# EAGLE design moon-rover (EAGLE 6.3)
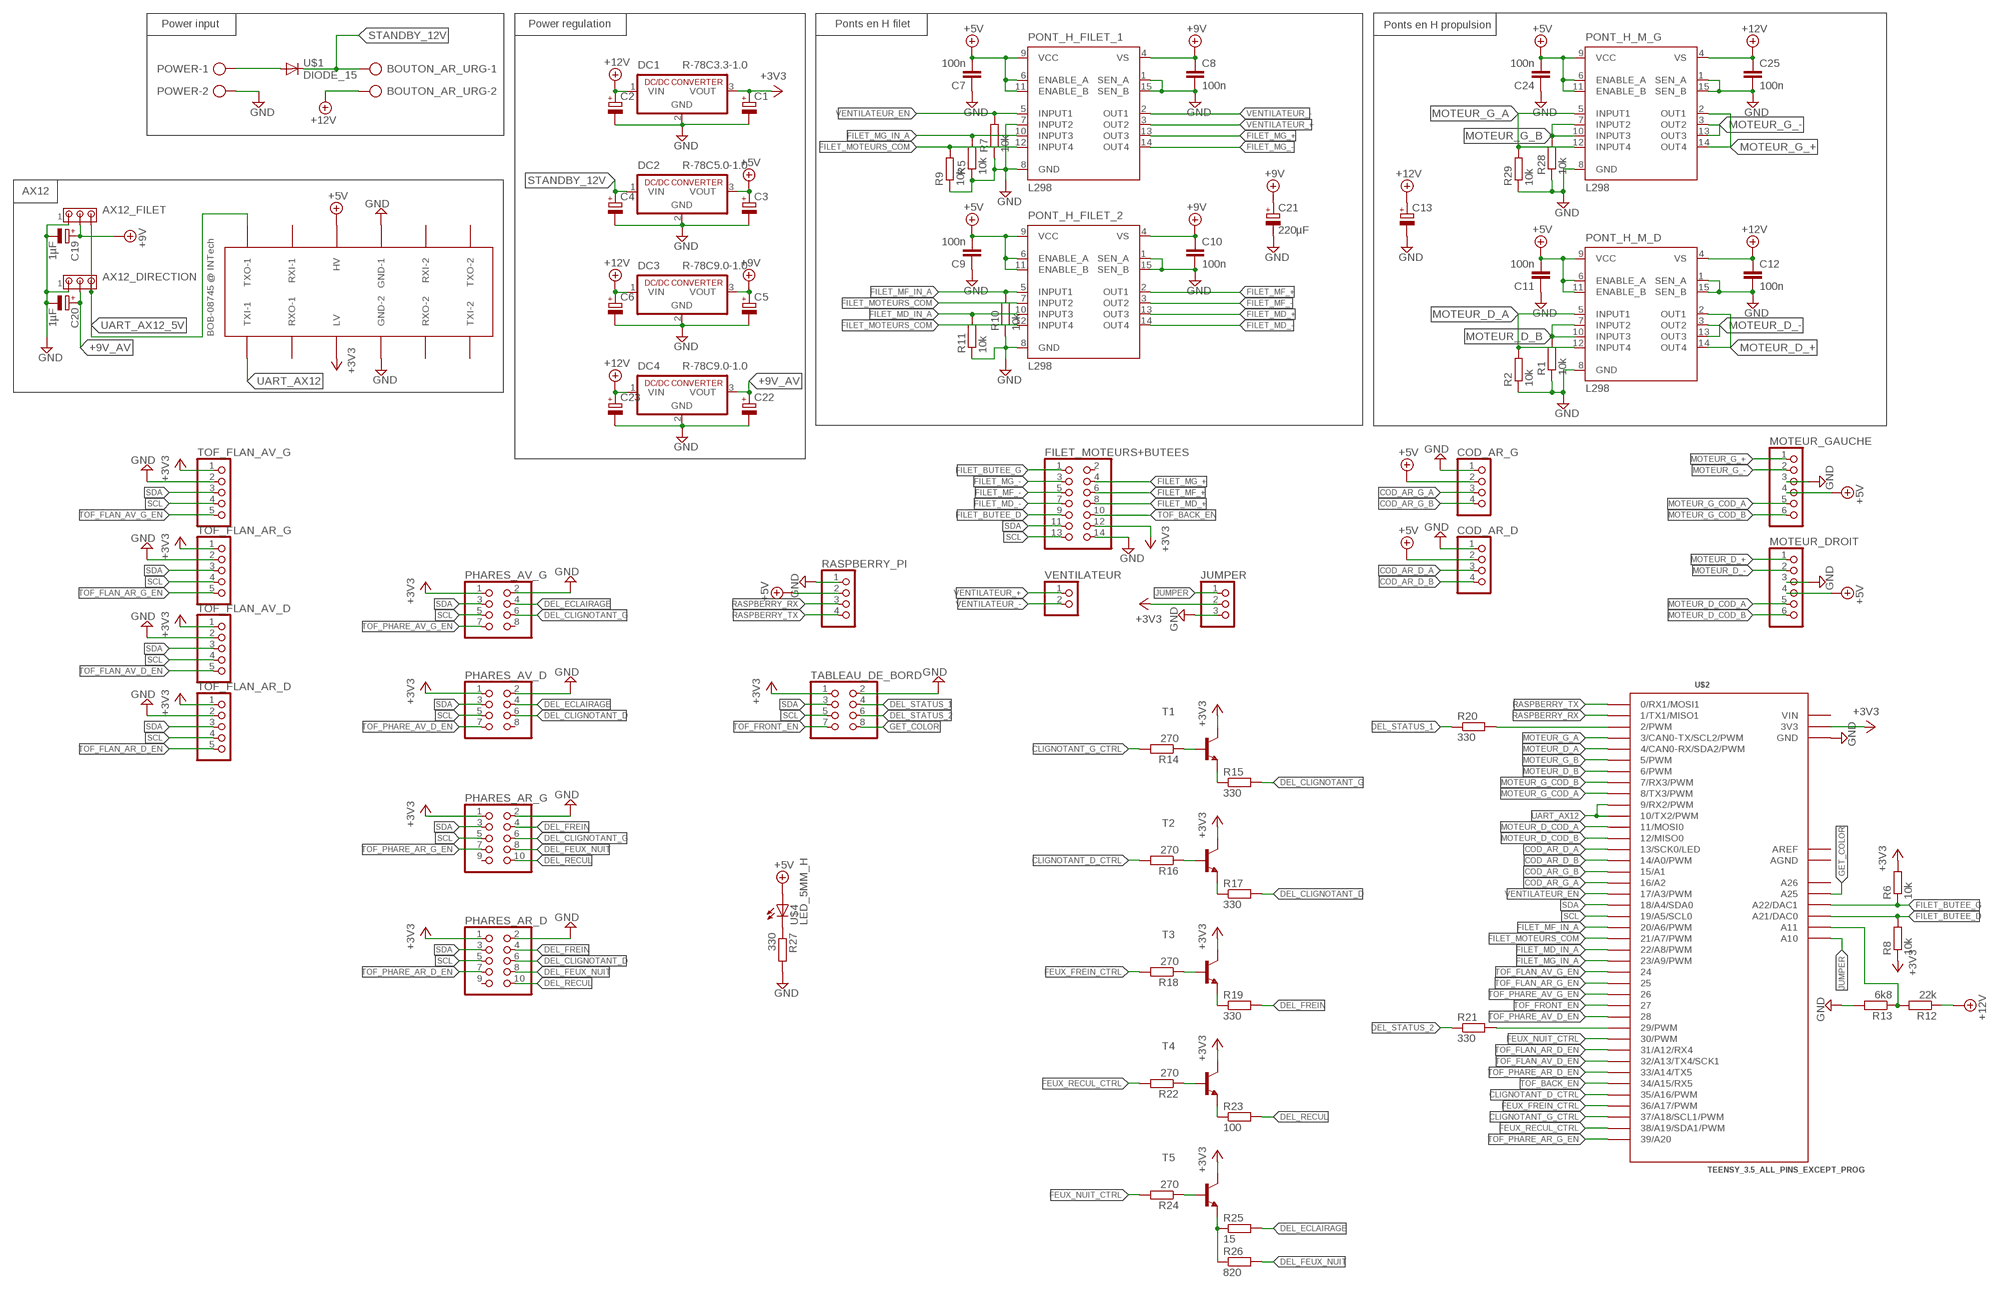
[diagram p0: schematic, sheet 1]

## Parts
AX12_DIRECTION  MTA03-100  [10X03MTA]
AX12_FILET  MTA03-100  [10X03MTA]
BOUTON_AR_URG  AK300/2  [AK300/2]
C1  CPOL-EUE2.5-6  [E2,5-6]
C2  CPOL-EUE2.5-6  [E2,5-6]
C3  CPOL-EUE2.5-6  [E2,5-6]
C4  CPOL-EUE2.5-6  [E2,5-6]
C5  CPOL-EUE2.5-6  [E2,5-6]
C6  CPOL-EUE2.5-6  [E2,5-6]
C7  100n  C-EU050-024X044  [C050-024X044]
C8  100n  C-EU050-024X044  [C050-024X044]
C9  100n  C-EU050-024X044  [C050-024X044]
C10  100n  C-EU050-024X044  [C050-024X044]
C11  100n  C-EU050-024X044  [C050-024X044]
C12  100n  C-EU050-024X044  [C050-024X044]
C13  CPOL-EUE5-13  [E5-13]
C19  1µF  CPOL-EUE2.5-5  [E2,5-5]
C20  1µF  CPOL-EUE2.5-5  [E2,5-5]
C21  220µF  CPOL-EUE3.5-8  [E3,5-8]
C22  CPOL-EUE2.5-6  [E2,5-6]
C23  CPOL-EUE2.5-6  [E2,5-6]
C24  100n  C-EU050-024X044  [C050-024X044]
C25  100n  C-EU050-024X044  [C050-024X044]
COD_AR_D  PINHD-1X4/90  [1X04/90]
COD_AR_G  PINHD-1X4/90  [1X04/90]
DC1  R-78C3.3-1.0  [SIP3]
DC2  R-78C5.0-1.0  [SIP3]
DC3  R-78C9.0-1.0  [SIP3]
DC4  R-78C9.0-1.0  [SIP3]
FILET_MOTEURS+BUTEES  PINHD-2X7  [2X07]
JUMPER  PINHD-1X3/90  [1X03/90]
MOTEUR_DROIT  PINHD-1X6/90  [1X06/90]
MOTEUR_GAUCHE  PINHD-1X6/90  [1X06/90]
PHARES_AR_D  PINHD-2X5  [2X05]
PHARES_AR_G  PINHD-2X5  [2X05]
PHARES_AV_D  PINHD-2X4  [2X04]
PHARES_AV_G  PINHD-2X4  [2X04]
PONT_H_FILET_1  L298  [MULTIWATT-15]
PONT_H_FILET_2  L298  [MULTIWATT-15]
PONT_H_M_D  L298  [MULTIWATT-15]
PONT_H_M_G  L298  [MULTIWATT-15]
POWER  AK300/2  [AK300/2]
R1  10k  R-EU_0204/7  [0204/7]
R2  10k  R-EU_0204/7  [0204/7]
R5  10k  R-EU_0204/7  [0204/7]
R6  10k  R-EU_0204/7  [0204/7]
R7  10k  R-EU_0204/7  [0204/7]
R8  10k  R-EU_0204/7  [0204/7]
R9  10k  R-EU_0204/7  [0204/7]
R10  10k  R-EU_0204/7  [0204/7]
R11  10k  R-EU_0204/7  [0204/7]
R12  22k  R-EU_0204/7  [0204/7]
R13  6k8  R-EU_0204/7  [0204/7]
R14  270  R-EU_0204/7  [0204/7]
R15  330  R-EU_0207/2V  [0207/2V]
R16  270  R-EU_0204/7  [0204/7]
R17  330  R-EU_0207/2V  [0207/2V]
R18  270  R-EU_0204/7  [0204/7]
R19  330  R-EU_0207/2V  [0207/2V]
R20  330  R-EU_0204/7  [0204/7]
R21  330  R-EU_0207/2V  [0207/2V]
R22  270  R-EU_0204/7  [0204/7]
R23  100  R-EU_0207/2V  [0207/2V]
R24  270  R-EU_0207/2V  [0207/2V]
R25  15  R-EU_0207/2V  [0207/2V]
R26  820  R-EU_0207/2V  [0207/2V]
R27  330  R-EU_0204/7  [0204/7]
R28  10k  R-EU_0204/7  [0204/7]
R29  10k  R-EU_0204/7  [0204/7]
RASPBERRY_PI  PINHD-1X4/90  [1X04/90]
T1  BC237-NPN-TO92-CBE  [TO92-CBE]
T2  BC237-NPN-TO92-CBE  [TO92-CBE]
T3  BC237-NPN-TO92-CBE  [TO92-CBE]
T4  BC237-NPN-TO92-CBE  [TO92-CBE]
T5  BC237-NPN-TO92-CBE  [TO92-CBE]
TABLEAU_DE_BORD  PINHD-2X4  [2X04]
TOF_FLAN_AR_D  PINHD-1X5  [1X05]
TOF_FLAN_AR_G  PINHD-1X5  [1X05]
TOF_FLAN_AV_D  PINHD-1X5  [1X05]
TOF_FLAN_AV_G  PINHD-1X5  [1X05]
U$1  DIODE_15  [DO201-15]
U$2  TEENSY_3.5_ALL_PINS_EXCEPT_PROG  [TEENSY_3.5_ALL_PINS_EXCEPT_PROG]
U$3  BOB-08745  [BOB-08745]
U$4  LED_5MM_H  [Q62902-B155]
VENTILATEUR  PINHD-1X2/90  [1X02/90]

## Nets
+3V3: C1.+ DC1.3(VOUT) FILET_MOTEURS+BUTEES.12 JUMPER.2 PHARES_AR_D.1 PHARES_AR_G.1 PHARES_AV_D.1 PHARES_AV_G.1 R6.2 R8.1 T1.C T2.C T3.C T4.C T5.C TABLEAU_DE_BORD.1 TOF_FLAN_AR_D.1 TOF_FLAN_AR_G.1 TOF_FLAN_AV_D.1 TOF_FLAN_AV_G.1 U$2.3.3V3(3V3) U$2.3.3V(3V3) U$3.LV
+5V: C3.+ C7.2 C9.2 C11.2 C24.2 COD_AR_D.2 COD_AR_G.2 DC2.3(VOUT) MOTEUR_DROIT.4 MOTEUR_GAUCHE.4 PONT_H_FILET_1.6(ENABLE_A) PONT_H_FILET_1.9(VCC) PONT_H_FILET_1.11(ENABLE_B) PONT_H_FILET_2.6(ENABLE_A) PONT_H_FILET_2.9(VCC) PONT_H_FILET_2.11(ENABLE_B) PONT_H_M_D.6(ENABLE_A) PONT_H_M_D.9(VCC) PONT_H_M_D.11(ENABLE_B) PONT_H_M_G.6(ENABLE_A) PONT_H_M_G.9(VCC) PONT_H_M_G.11(ENABLE_B) RASPBERRY_PI.2 U$3.HV U$4.A+
+9V: AX12_FILET.2 C5.+ C8.1 C10.1 C19.+ C21.+ DC3.3(VOUT) PONT_H_FILET_1.4(VS) PONT_H_FILET_2.4(VS)
+9V_AV: AX12_DIRECTION.2 C20.+ C22.+ DC4.3(VOUT)
+12V: BOUTON_AR_URG.2 C2.+ C6.+ C12.1 C13.+ C23.+ C25.1 DC1.1(VIN) DC3.1(VIN) DC4.1(VIN) PONT_H_M_D.4(VS) PONT_H_M_G.4(VS) R12.1
CLIGNOTANT_D_CTRL: R16.2 U$2.35/A16(35/A16/PWM)
CLIGNOTANT_G_CTRL: R14.2 U$2.37/A18(37/A18/SCL1/PWM)
COD_AR_D_A: COD_AR_D.3 U$2.13(13/SCK0/LED)
COD_AR_D_B: COD_AR_D.4 U$2.14/A0(14/A0/PWM)
COD_AR_G_A: COD_AR_G.3 U$2.16/A2
COD_AR_G_B: COD_AR_G.4 U$2.15/A1
DEL_CLIGNOTANT_D: PHARES_AR_D.6 PHARES_AV_D.6 R17.2
DEL_CLIGNOTANT_G: PHARES_AR_G.6 PHARES_AV_G.6 R15.2
DEL_ECLAIRAGE: PHARES_AV_D.4 PHARES_AV_G.4 R25.2
DEL_FEUX_NUIT: PHARES_AR_D.8 PHARES_AR_G.8 R26.2
DEL_FREIN: PHARES_AR_D.4 PHARES_AR_G.4 R19.2
DEL_RECUL: PHARES_AR_D.10 PHARES_AR_G.10 R23.2
DEL_STATUS_1: R20.1 TABLEAU_DE_BORD.4
DEL_STATUS_2: R21.1 TABLEAU_DE_BORD.6
FEUX_FREIN_CTRL: R18.2 U$2.36/A17(36/A17/PWM)
FEUX_NUIT_CTRL: R24.2 U$2.30(30/PWM)
FEUX_RECUL_CTRL: R22.2 U$2.38/A19(38/A19/SDA1/PWM)
FILET_BUTEE_D: FILET_MOTEURS+BUTEES.9 R8.2 U$2.A21(A21/DAC0)
FILET_BUTEE_G: FILET_MOTEURS+BUTEES.1 R6.1 U$2.A22(A22/DAC1)
FILET_MD_+: FILET_MOTEURS+BUTEES.8 PONT_H_FILET_2.13(OUT3)
FILET_MD_-: FILET_MOTEURS+BUTEES.7 PONT_H_FILET_2.14(OUT4)
FILET_MD_IN_A: PONT_H_FILET_2.10(INPUT3) R11.2 U$2.22/A8(22/A8/PWM)
FILET_MF_+: FILET_MOTEURS+BUTEES.6 PONT_H_FILET_2.2(OUT1)
FILET_MF_-: FILET_MOTEURS+BUTEES.5 PONT_H_FILET_2.3(OUT2)
FILET_MF_IN_A: PONT_H_FILET_2.5(INPUT1) R10.2 U$2.20/A6(20/A6/PWM)
FILET_MG_+: FILET_MOTEURS+BUTEES.4 PONT_H_FILET_1.13(OUT3)
FILET_MG_-: FILET_MOTEURS+BUTEES.3 PONT_H_FILET_1.14(OUT4)
FILET_MG_IN_A: PONT_H_FILET_1.10(INPUT3) R5.2 U$2.23/A9(23/A9/PWM)
FILET_MOTEURS_COM: PONT_H_FILET_1.12(INPUT4) PONT_H_FILET_2.7(INPUT2) PONT_H_FILET_2.12(INPUT4) R9.2 U$2.21/A7(21/A7/PWM)
GET_COLOR: TABLEAU_DE_BORD.8 U$2.A25
GND: AX12_DIRECTION.1 AX12_FILET.1 C1.- C2.- C3.- C4.- C5.- C6.- C7.1 C8.2 C9.1 C10.2 C11.1 C12.2 C13.- C19.- C20.- C21.- C22.- C23.- C24.1 C25.2 COD_AR_D.1 COD_AR_G.1 DC1.2(GND) DC2.2(GND) DC3.2(GND) DC4.2(GND) FILET_MOTEURS+BUTEES.14 JUMPER.3 MOTEUR_DROIT.3 MOTEUR_GAUCHE.3 PHARES_AR_D.2 PHARES_AR_G.2 PHARES_AV_D.2 PHARES_AV_G.2 PONT_H_FILET_1.1(SEN_A) PONT_H_FILET_1.7(INPUT2) PONT_H_FILET_1.8(GND) PONT_H_FILET_1.15(SEN_B) PONT_H_FILET_2.1(SEN_A) PONT_H_FILET_2.8(GND) PONT_H_FILET_2.15(SEN_B) PONT_H_M_D.1(SEN_A) PONT_H_M_D.8(GND) PONT_H_M_D.15(SEN_B) PONT_H_M_G.1(SEN_A) PONT_H_M_G.8(GND) PONT_H_M_G.15(SEN_B) POWER.2 R1.1 R2.1 R5.1 R7.1 R9.1 R10.1 R11.1 R13.2 R27.2 R28.1 R29.1 RASPBERRY_PI.1 TABLEAU_DE_BORD.2 TOF_FLAN_AR_D.2 TOF_FLAN_AR_G.2 TOF_FLAN_AV_D.2 TOF_FLAN_AV_G.2 U$2.GND U$2.GND1(GND) U$2.GND3(GND) U$2.GND4(GND) U$3.GND-1 U$3.GND-2
JUMPER: JUMPER.1 U$2.A10
MOTEUR_D_+: MOTEUR_DROIT.1 PONT_H_M_D.2(OUT1) PONT_H_M_D.14(OUT4)
MOTEUR_D_-: MOTEUR_DROIT.2 PONT_H_M_D.3(OUT2) PONT_H_M_D.13(OUT3)
MOTEUR_D_A: PONT_H_M_D.5(INPUT1) PONT_H_M_D.12(INPUT4) R2.2 U$2.4(4/CAN0-RX/SDA2/PWM)
MOTEUR_D_B: PONT_H_M_D.7(INPUT2) PONT_H_M_D.10(INPUT3) R1.2 U$2.6(6/PWM)
MOTEUR_D_COD_A: MOTEUR_DROIT.5 U$2.11(11/MOSI0)
MOTEUR_D_COD_B: MOTEUR_DROIT.6 U$2.12(12/MISO0)
MOTEUR_G_+: MOTEUR_GAUCHE.1 PONT_H_M_G.2(OUT1) PONT_H_M_G.14(OUT4)
MOTEUR_G_-: MOTEUR_GAUCHE.2 PONT_H_M_G.3(OUT2) PONT_H_M_G.13(OUT3)
MOTEUR_G_A: PONT_H_M_G.5(INPUT1) PONT_H_M_G.12(INPUT4) R29.2 U$2.3(3/CAN0-TX/SCL2/PWM)
MOTEUR_G_B: PONT_H_M_G.7(INPUT2) PONT_H_M_G.10(INPUT3) R28.2 U$2.5(5/PWM)
MOTEUR_G_COD_A: MOTEUR_GAUCHE.5 U$2.8(8/TX3/PWM)
MOTEUR_G_COD_B: MOTEUR_GAUCHE.6 U$2.7(7/RX3/PWM)
N$2: R14.1 T1.B
N$4: R12.2 R13.1 U$2.A11
N$5: R15.1 T1.E
N$8: R27.1 U$4.K-(C-)
N$9: POWER.1 U$1.A(A+)
N$11: R16.1 T2.B
N$12: R17.1 T2.E
N$15: R18.1 T3.B
N$16: R19.1 T3.E
N$19: R20.2 U$2.2(2/PWM)
N$20: R21.2 U$2.29(29/PWM)
N$21: R22.1 T4.B
N$22: R23.1 T4.E
N$25: R24.1 T5.B
N$26: R25.1 R26.1 T5.E
RASPBERRY_RX: RASPBERRY_PI.3 U$2.1(1/TX1/MISO1)
RASPBERRY_TX: RASPBERRY_PI.4 U$2.0(0/RX1/MOSI1)
SCL: FILET_MOTEURS+BUTEES.13 PHARES_AR_D.5 PHARES_AR_G.5 PHARES_AV_D.5 PHARES_AV_G.5 TABLEAU_DE_BORD.5 TOF_FLAN_AR_D.4 TOF_FLAN_AR_G.4 TOF_FLAN_AV_D.4 TOF_FLAN_AV_G.4 U$2.19/A5(19/A5/SCL0)
SDA: FILET_MOTEURS+BUTEES.11 PHARES_AR_D.3 PHARES_AR_G.3 PHARES_AV_D.3 PHARES_AV_G.3 TABLEAU_DE_BORD.3 TOF_FLAN_AR_D.3 TOF_FLAN_AR_G.3 TOF_FLAN_AV_D.3 TOF_FLAN_AV_G.3 U$2.18/A4(18/A4/SDA0)
STANDBY_12V: BOUTON_AR_URG.1 C4.+ DC2.1(VIN) U$1.C(C-)
TOF_BACK_EN: FILET_MOTEURS+BUTEES.10 U$2.34/A15(34/A15/RX5)
TOF_FLAN_AR_D_EN: TOF_FLAN_AR_D.5 U$2.31/A12(31/A12/RX4)
TOF_FLAN_AR_G_EN: TOF_FLAN_AR_G.5 U$2.25
TOF_FLAN_AV_D_EN: TOF_FLAN_AV_D.5 U$2.32/A13(32/A13/TX4/SCK1)
TOF_FLAN_AV_G_EN: TOF_FLAN_AV_G.5 U$2.24
TOF_FRONT_EN: TABLEAU_DE_BORD.7 U$2.27
TOF_PHARE_AR_D_EN: PHARES_AR_D.7 U$2.33/A14(33/A14/TX5)
TOF_PHARE_AR_G_EN: PHARES_AR_G.7 U$2.39/A20
TOF_PHARE_AV_D_EN: PHARES_AV_D.7 U$2.28
TOF_PHARE_AV_G_EN: PHARES_AV_G.7 U$2.26
UART_AX12: U$2.9(9/RX2/PWM) U$2.10(10/TX2/PWM) U$3.TXI-1
UART_AX12_5V: AX12_DIRECTION.3 AX12_FILET.3 U$3.TXO-1
VENTILATEUR_+: PONT_H_FILET_1.3(OUT2) VENTILATEUR.1
VENTILATEUR_-: PONT_H_FILET_1.2(OUT1) VENTILATEUR.2
VENTILATEUR_EN: PONT_H_FILET_1.5(INPUT1) R7.2 U$2.17/A3(17/A3/PWM)
Unconnected: FILET_MOTEURS+BUTEES.2 PHARES_AR_D.9 PHARES_AR_G.9 PHARES_AV_D.8 PHARES_AV_G.8 U$2.A26 U$3.RXI-1 U$3.RXI-2 U$3.RXO-1 U$3.RXO-2 U$3.TXI-2 U$3.TXO-2

## Notes on the sheet
- Power input | Power regulation | Ponts en H filet | Ponts en H propulsion
- AX12

## Power pins joined to a net without a drawn wire
AGND: U$2.AGND
AREF: U$2.AREF
VIN: U$2.VIN

## Library data of the parts
AX12_DIRECTION AX12_FILET = con-amp:MTA03-100: AMP connector
BOUTON_AR_URG POWER = con-ptr500:AK300/2: CONNECTOR; OC_FARNELL: unknown; OC_NEWARK: unknown
C1-C6 C19-C23 = 1NTech_RLCD:CPOL-EU: POLARIZED CAPACITOR, European symbol
C7-C12 C24 C25 = 1NTech_RLCD:C-EU: CAPACITOR, European symbol
C13 = resistor:CPOL-EU: POLARIZED CAPACITOR, European symbol
COD_AR_D COD_AR_G RASPBERRY_PI = pinhead:PINHD-1X4: PIN HEADER
DC1-DC4 = dc-dc-converter:R-78C*-1.0: INNOLINE DC/DC-Converter 1.0 AMP SIP3 Single Output Source: Data sheet <http://www.mikrocontroller.net/attachment/150645/157764-da-01-en-DC_DC_WANDLER_R_78C5_0_1_0.pdf>
FILET_MOTEURS+BUTEES = pinhead:PINHD-2X7: PIN HEADER
JUMPER = pinhead:PINHD-1X3: PIN HEADER
MOTEUR_DROIT MOTEUR_GAUCHE = pinhead:PINHD-1X6: PIN HEADER
PHARES_AR_D PHARES_AR_G = pinhead:PINHD-2X5: PIN HEADER
PHARES_AV_D PHARES_AV_G TABLEAU_DE_BORD = pinhead:PINHD-2X4: PIN HEADER
PONT_H_FILET_1 PONT_H_FILET_2 PONT_H_M_D PONT_H_M_G = st-microelectronics:L298: DUAL FULL-BRIDGE DRIVER; MPN: L298N; OC_FARNELL: 1589425; OC_NEWARK: 32M1527
R1 R2 R5-R29 = 1NTech_RLCD:R-EU_: RESISTOR, European symbol
T1-T5 = transistor:*-NPN-: NPN Transistror BF959 corrected 2008.03.06
TOF_FLAN_AR_D TOF_FLAN_AR_G TOF_FLAN_AV_D TOF_FLAN_AV_G = pinhead:PINHD-1X5: PIN HEADER
U$1 = 1NTech_RLCD:DIODE
U$2 = Teensy_3_and_LC_Series_Boards_v1.4:TEENSY_3.5_ALL_PINS_EXCEPT_PROG
U$3 = BOB-08745_CF_INTech:BOB-08745: Convertisseur de niveau logique BOB-08745
U$4 = 1NTech_RLCD:LED
VENTILATEUR = pinhead:PINHD-1X2: PIN HEADER

## Board
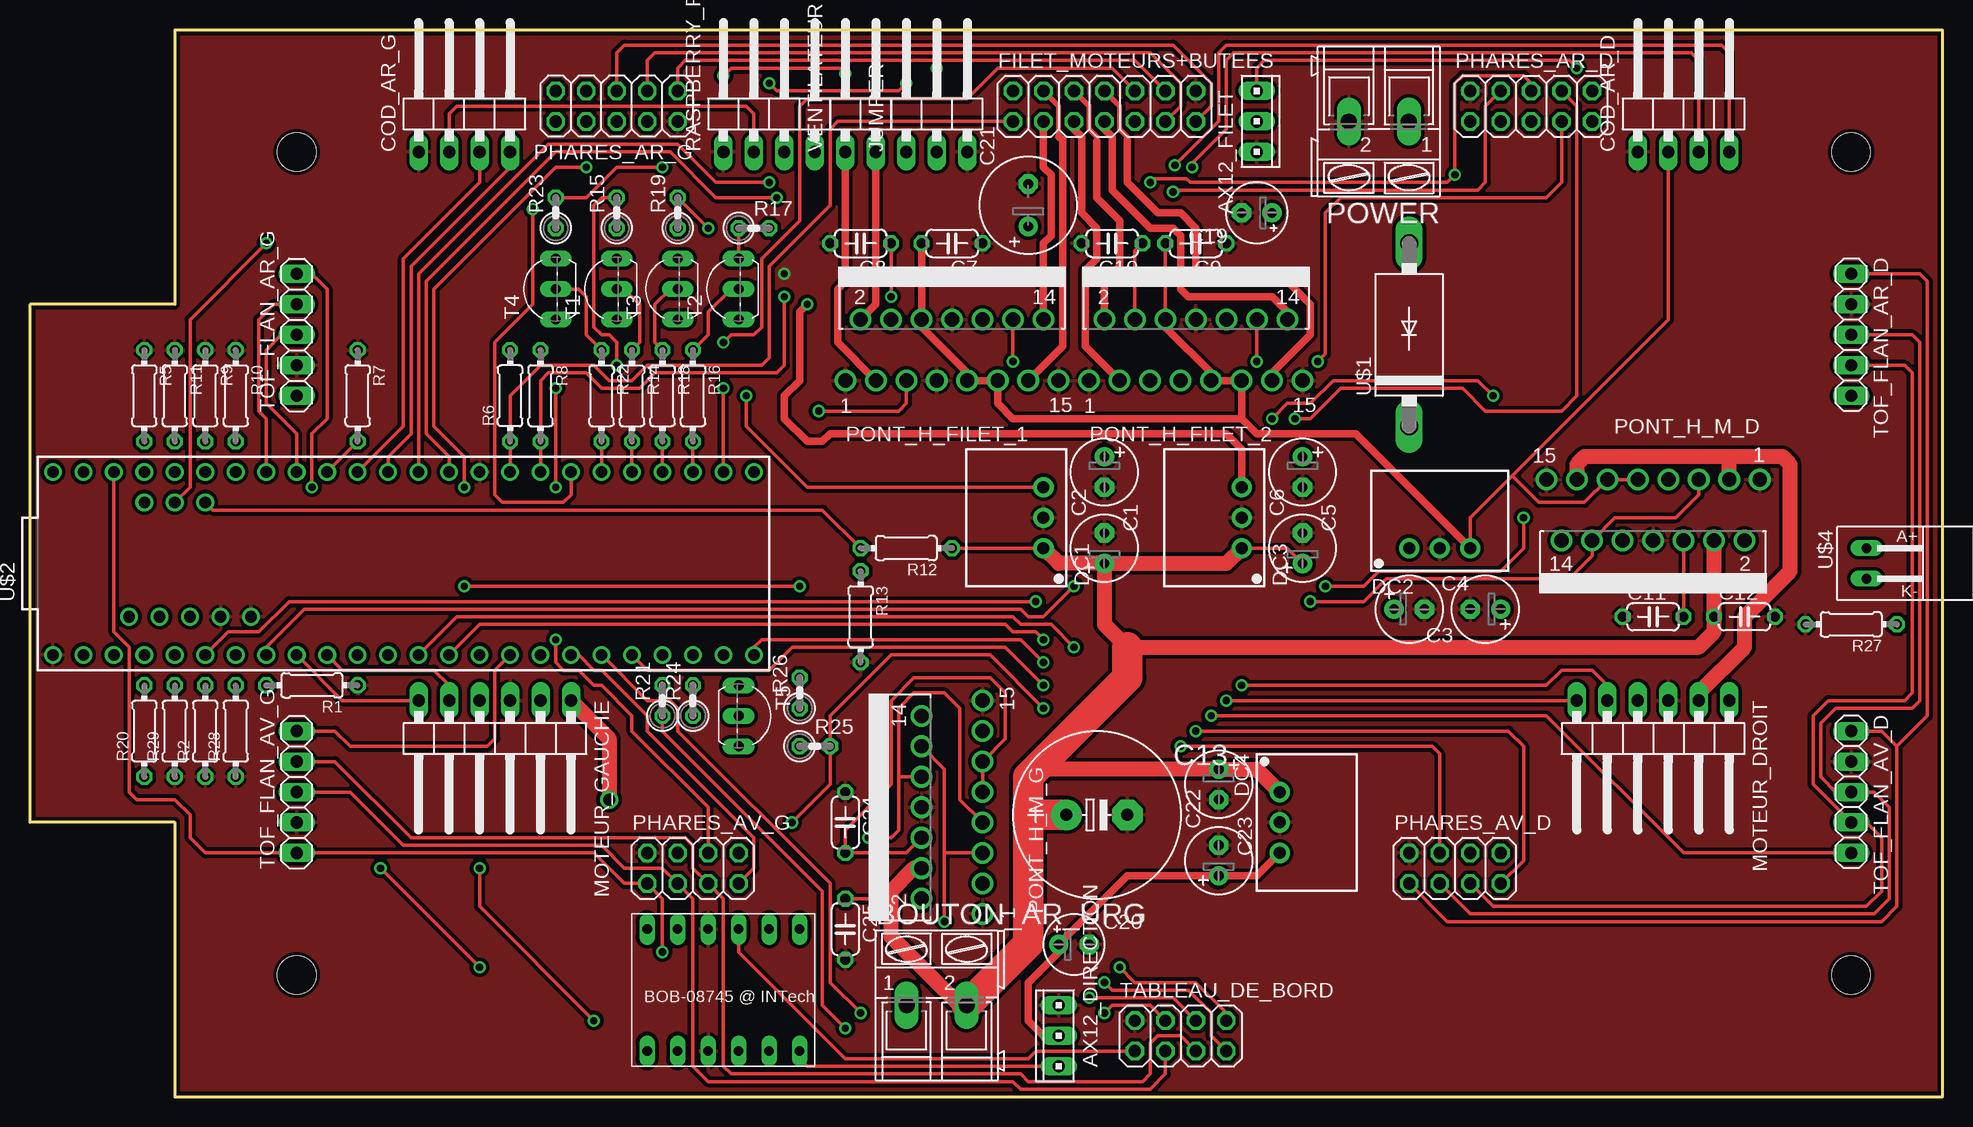
[diagram p1: board, top side]
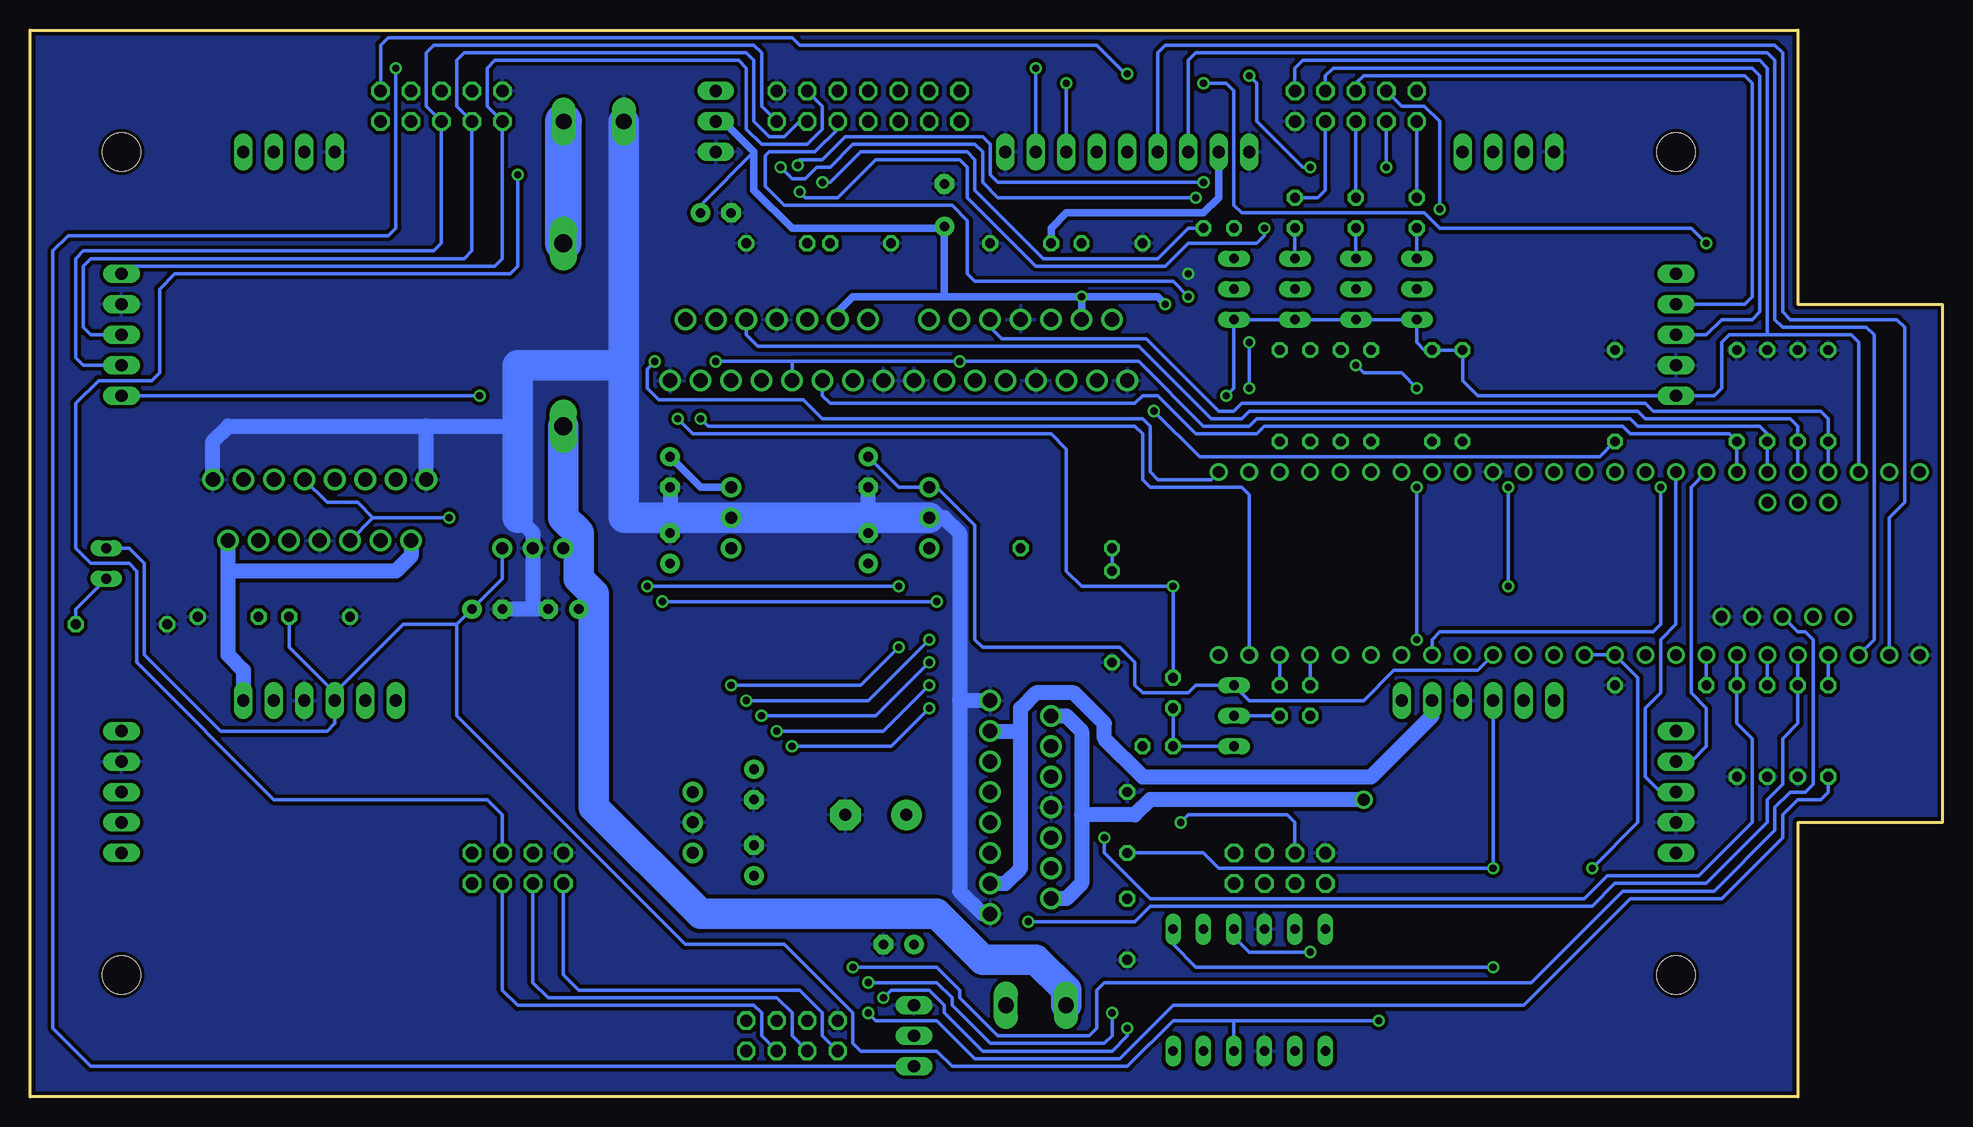
[diagram p2: board, bottom side, seen from below]

Size 159.38 x 88.9 mm. Coordinates in mm from the lower left corner, seen from the top.
Outline: 12.06,0 159.38,0 159.38,88.9 12.06,88.9 12.06,66.04 0,66.04 0,22.86 12.06,22.86 12.06,0
Copper layers (1*16): Top 0.035mm / dielectric 1.5mm / Bottom 0.035mm
Design rules "default *": minimum track width 12mil, minimum drill 23mil, track to track 12mil, track to pad 12mil, pad to pad 12mil, via to via 12mil, smd to smd 8mil, copper to edge 12mil, drill to drill 8mil, minimum pad ring 10mil, minimum via ring 8mil, stop-mask expansion 4mil, vias tented up to drill 0mil, thermal gap 10mil
Holes 3.2 mm at 22.23,10.16 22.23,78.74 151.76,78.74 151.76,10.16

### Footprints (pad centres in the part's own frame; a part is rotated, then mirrored left to right if it is on the bottom)
10X03MTA = drill 1.016 long: 1 2.54,0; 2 0,0; 3 -2.54,0
AK300/2 = drill 1.321 long: 1 -2.515,0; 2 2.489,0
E2,5-6 = drill 0.813 pad 1.6: + -1.27,0 | drill 0.813 pad 1.6 octagon: - 1.27,0
C050-024X044 = drill 0.813 octagon: 1 -2.54,0; 2 2.54,0
E5-13 = drill 1.016 pad 2.54: + -2.54,0 | drill 1.016 pad 2.54 octagon: - 2.54,0
E2,5-5 = drill 0.813 pad 1.6: + -1.27,0 | drill 0.813 pad 1.6 octagon: - 1.27,0
E3,5-8 = drill 0.813 pad 1.6: + -1.778,0 | drill 0.813 pad 1.6 octagon: - 1.778,0
1X04/90 = drill 1.016 long: 1 -3.81,-3.81; 2 -1.27,-3.81; 3 1.27,-3.81; 4 3.81,-3.81
SIP3 = drill 1 pad 1.676: 1 -2.54,0; 2 0,0; 3 2.54,0
2X07 = drill 1.016 octagon: 1 -7.62,-1.27; 2 -7.62,1.27; 3 -5.08,-1.27; 4 -5.08,1.27; 5 -2.54,-1.27; 6 -2.54,1.27; 7 0,-1.27; 8 0,1.27; 9 2.54,-1.27; 10 2.54,1.27; 11 5.08,-1.27; 12 5.08,1.27; 13 7.62,-1.27; 14 7.62,1.27
1X03/90 = drill 1.016 long: 1 -2.54,-3.81; 2 0,-3.81; 3 2.54,-3.81
1X06/90 = drill 1.016 long: 1 -6.35,-3.81; 2 -3.81,-3.81; 3 -1.27,-3.81; 4 1.27,-3.81; 5 3.81,-3.81; 6 6.35,-3.81
2X05 = drill 1.016 octagon: 1 -5.08,-1.27; 2 -5.08,1.27; 3 -2.54,-1.27; 4 -2.54,1.27; 5 0,-1.27; 6 0,1.27; 7 2.54,-1.27; 8 2.54,1.27; 9 5.08,-1.27; 10 5.08,1.27
2X04 = drill 1.016 octagon: 1 -3.81,-1.27; 2 -3.81,1.27; 3 -1.27,-1.27; 4 -1.27,1.27; 5 1.27,-1.27; 6 1.27,1.27; 7 3.81,-1.27; 8 3.81,1.27
MULTIWATT-15 = drill 1.2: 1 -8.89,-7.62; 2 -7.62,-2.54; 3 -6.35,-7.62; 4 -5.08,-2.54; 5 -3.81,-7.62; 6 -2.54,-2.54; 7 -1.27,-7.62; 8 0,-2.54; 9 1.27,-7.62; 10 2.54,-2.54; 11 3.81,-7.62; 12 5.08,-2.54; 13 6.35,-7.62; 14 7.62,-2.54; 15 8.89,-7.62
0204/7 = drill 0.813 octagon: 1 -3.81,0; 2 3.81,0
0207/2V = drill 0.813 octagon: 1 -1.27,0; 2 1.27,0
TO92-CBE = drill 0.813 long: B 0,0; C -2.54,0; E 2.54,0
1X05 = drill 1.016 long: 1 -5.08,0; 2 -2.54,0; 3 0,0; 4 2.54,0; 5 5.08,0
DO201-15 = drill 1.499 long: A 7.62,0; C -7.62,0
TEENSY_3.5_ALL_PINS_EXCEPT_PROG = drill 0.965: 0 -7.62,27.94; 1 -7.62,25.4; 2 -7.62,22.86; 3 -7.62,20.32; 3.3V 7.62,25.4; 3.3V3 -7.62,-5.08; 4 -7.62,17.78; 5 -7.62,15.24; 6 -7.62,12.7; 7 -7.62,10.16; 8 -7.62,7.62; 9 -7.62,5.08; 10 -7.62,2.54; 11 -7.62,0; 12 -7.62,-2.54; 13 7.62,-2.54; 14/A0 7.62,0; 15/A1 7.62,2.54; 16/A2 7.62,5.08; 17/A3 7.62,7.62; 18/A4 7.62,10.16; 19/A5 7.62,12.7; 20/A6 7.62,15.24; 21/A7 7.62,17.78; 22/A8 7.62,20.32; 23/A9 7.62,22.86; 24 -7.62,-7.62; 25 -7.62,-10.16; 26 -7.62,-12.7; 27 -7.62,-15.24; 28 -7.62,-17.78; 29 -7.62,-20.32; 30 -7.62,-22.86; 31/A12 -7.62,-25.4; 32/A13 -7.62,-27.94; 33/A14 7.62,-27.94; 34/A15 7.62,-25.4; 35/A16 7.62,-22.86; 36/A17 7.62,-20.32; 37/A18 7.62,-17.78; 38/A19 7.62,-15.24; 39/A20 7.62,-12.7; A10 5.08,20.32; A11 5.08,17.78; A21 7.62,-10.16; A22 7.62,-7.62; A25 -4.445,19.05; A26 -4.445,21.59; AGND 7.62,27.94; AREF 5.08,22.86; GND -7.62,30.48; GND1 7.62,-5.08; GND3 -4.445,16.51; GND4 -4.445,13.97; NC -4.445,24.13; VIN 7.62,30.48
BOB-08745 = drill 0.8 long: GND-1 1.27,5.08; GND-2 1.27,-5.08; HV -1.27,5.08; LV -1.27,-5.08; RXI-1 -3.81,5.08; RXI-2 3.81,5.08; RXO-1 -3.81,-5.08; RXO-2 3.81,-5.08; TXI-1 -6.35,-5.08; TXI-2 6.35,-5.08; TXO-1 -6.35,5.08; TXO-2 6.35,5.08
Q62902-B155 = drill 0.813 long: A+ 7.62,-1.27; K- 7.62,1.27
1X02/90 = drill 1.016 long: 1 -1.27,-3.81; 2 1.27,-3.81

### Placement (x,y rotation side)
AX12_DIRECTION  85.72,5.08 90 top
AX12_FILET  102.23,81.28 270 top
BOUTON_AR_URG  75.56,7.62 0 top
C1  89.53,52.07 270 top
C2  89.53,45.72 90 top
C3  121.28,40.64 180 top
C4  114.94,40.64 0 top
C5  106.05,52.07 270 top
C6  106.05,45.72 90 top
C7  76.83,71.12 180 top
C8  69.22,71.12 180 top
C9  97.16,71.12 180 top
C10  90.17,71.12 180 top
C11  135.25,40.01 0 top
C12  142.88,40.01 0 top
C13  88.9,23.5 0 top
C19  102.23,73.66 180 top
C20  87,12.7 0 top
C21  83.19,74.3 90 top
C22  99.06,19.68 90 top
C23  99.06,26.04 270 top
C24  67.95,22.86 270 top
C25  67.95,13.97 270 top
COD_AR_D  137.8,82.55 0 top
COD_AR_G  36.2,82.55 0 top
DC1  84.45,48.26 90 top
DC2  117.47,45.72 0 top
DC3  100.97,48.26 90 top
DC4  104.14,22.86 270 top
FILET_MOTEURS+BUTEES  89.53,82.55 0 top
JUMPER  75.56,82.55 0 top
MOTEUR_DROIT  135.25,29.21 180 top
MOTEUR_GAUCHE  38.73,29.21 180 top
PHARES_AR_D  125.09,82.55 0 top
PHARES_AR_G  48.89,82.55 180 top
PHARES_AV_D  118.75,19.05 0 top
PHARES_AV_G  55.24,19.05 0 top
PONT_H_FILET_1  76.83,67.31 0 top
PONT_H_FILET_2  97.16,67.31 0 top
PONT_H_M_D  135.25,43.81 180 top
PONT_H_M_G  71.75,24.13 90 top
POWER  112.39,81.28 180 top
R1  23.49,34.29 180 top
R2  14.61,30.48 90 top
R5  9.52,58.42 270 top
R6  40.01,58.42 90 top
R7  27.3,58.42 270 top
R8  42.55,58.42 270 top
R9  14.61,58.42 270 top
R10  17.14,58.42 270 top
R11  12.06,58.42 270 top
R12  73.03,45.72 180 top
R13  69.22,40.01 270 top
R14  50.16,58.42 270 top
R15  48.89,73.66 90 top
R16  55.24,58.42 270 top
R17  60.32,72.39 0 top
R18  52.7,58.42 270 top
R19  53.97,73.66 90 top
R20  9.52,30.48 90 top
R21  52.7,33.02 90 top
R22  47.62,58.42 270 top
R23  43.81,73.66 90 top
R24  55.24,33.02 90 top
R25  65.41,29.21 0 top
R26  64.14,33.66 90 top
R27  151.76,39.37 180 top
R28  17.14,30.48 90 top
R29  12.06,30.48 90 top
RASPBERRY_PI  61.59,82.55 0 top
T1  48.89,67.31 90 top
T2  59.05,67.31 90 top
T3  53.97,67.31 90 top
T4  43.81,67.31 90 top
T5  59.05,31.75 270 top
TABLEAU_DE_BORD  95.88,5.08 0 top
TOF_FLAN_AR_D  151.76,63.5 270 top
TOF_FLAN_AR_G  22.23,63.5 90 top
TOF_FLAN_AV_D  151.76,25.4 270 top
TOF_FLAN_AV_G  22.23,25.4 90 top
U$1  114.94,63.5 90 top
U$2  32.38,44.45 90 top
U$3  57.78,8.89 180 top
U$4  160.66,44.45 180 top
VENTILATEUR  69.22,82.55 0 top

### Tracks (layer width: path | path; a pad name or v marks a point on that pad's centre or on a via)
+3V3  (via drill 0.6)
  Top 0.305: TABLEAU_DE_BORD.1 83.82,3.81 83.19,3.17 67.95,3.17 59.05,12.06 U$3.LV | TOF_FLAN_AV_D.1 154.31,30.48 155.57,29.21 | 155.57,29.21 155.57,15.88 154.31,14.61 118.11,14.61 PHARES_AV_D.1 | TOF_FLAN_AR_D.1 157.48,68.58 158.12,67.94 158.12,31.75 155.57,29.21 | PHARES_AR_G.1 53.97,85.72 54.61,86.36 75.56,86.36 | 75.56,86.36 92.08,86.36 FILET_MOTEURS+BUTEES.12 | 75.56,86.36 v75.56,85.72 | DC1.3 64.77,50.8 59.69,55.88 v59.69,58.42 | U$2.3.3V 6.98,38.73 8.25,37.47 8.25,25.4 8.89,24.77 12.06,24.77 13.33,23.5 13.33,21.59 14.61,20.32 TOF_FLAN_AV_G.1 46.99,20.32 49.53,17.78 PHARES_AV_G.1 52.7,16.51 v52.7,12.06
  Bottom 0.305: TABLEAU_DE_BORD.1 93.34,5.08 93.34,6.99 95.25,8.89 113.66,8.89 114.94,10.16 PHARES_AV_D.1 | TOF_FLAN_AR_D.1 151.13,69.22 120.65,69.22 120.02,69.85 PHARES_AR_D.1 121.28,82.55 121.28,85.72 120.65,86.36 100.33,86.36 99.69,85.72 99.69,80.64 98.42,79.38 94.61,79.38 93.34,80.64 93.34,82.55 FILET_MOTEURS+BUTEES.12 | 14.61,63.5 14.61,85.72 15.24,86.36 53.34,86.36 53.97,85.72 PHARES_AR_G.1 | U$2.3.3V 6.98,62.87 7.62,63.5 14.61,63.5 | 14.61,63.5 17.78,63.5 18.41,62.87 18.41,59.05 19.05,58.42 TOF_FLAN_AR_G.1 38.73,58.42 40.01,59.69 R6.2 R8.1 43.18,62.23 43.81,62.87 T4.C T1.C T3.C T2.C 59.05,59.05 v59.69,58.42 | C1.+ 87,50.8 DC1.3 83.82,50.8 80.64,47.62 80.64,38.1 80.01,37.47 68.58,37.47 67.31,36.2 67.31,34.29 66.67,33.66 62.86,33.66 62.23,34.29 T5.C 57.78,33.02 48.26,33.02 45.72,35.56 38.73,35.56 U$2.3.3V3 | v75.56,85.72 JUMPER.2 | v52.7,12.06 57.78,12.06 59.05,13.34 U$3.LV
+5V  (via drill 0.6)
  Top 0.305: PONT_H_FILET_2.6 C9.2 | RASPBERRY_PI.2 60.32,81.92 59.69,82.55 35.56,82.55 34.92,81.92 COD_AR_G.2 | COD_AR_D.2 136.53,64.77 123.51,51.75 | 123.51,51.75 120.02,48.26 DC2.3 | PONT_H_M_D.6 C11.2 | PONT_H_M_D.9 PONT_H_M_D.11 129.54,49.53 125.73,49.53 123.51,51.75 | PONT_H_M_G.6 73.03,20.32 C24.2 67.95,22.23 71.75,26.04 71.75,33.02 73.66,34.92 80.01,34.92 81.28,33.66 81.28,29.84 PONT_H_M_G.11 PONT_H_M_G.9 | v46.99,6.35 37.46,15.88 v37.46,19.05
  Top 0.61: C7.2 PONT_H_FILET_1.6 74.3,64.14 78.11,60.33 PONT_H_FILET_1.9 PONT_H_FILET_1.11 80.64,57.78 81.91,56.52 100.97,56.52 | DC2.3 110.49,55.24 102.23,55.24 100.97,56.52 | 100.97,56.52 PONT_H_FILET_2.11 PONT_H_FILET_2.9 98.42,60.33 94.61,64.14 PONT_H_FILET_2.6
  Bottom 0.305: DC2.3 120.02,43.18 C3.+ 123.83,39.37 | U$4.A+ 151.13,45.72 149.86,44.45 149.86,36.83 143.51,30.48 134.62,30.48 133.99,31.11 MOTEUR_DROIT.4 133.99,33.66 | MOTEUR_GAUCHE.4 v37.46,19.05 60.32,19.05 61.59,20.32 C24.2 | v46.99,6.35 59.05,6.35 | 59.05,6.35 64.14,6.35 67.95,2.54 82.55,2.54 83.82,3.81 90.17,3.81 90.8,4.45 90.8,6.99 96.52,12.7 104.77,12.7 123.83,31.75 123.83,39.37 | U$3.HV 59.05,6.35 | 123.83,39.37 128.27,39.37 133.99,33.66 | C11.2 137.8,37.47 133.99,33.66
  Bottom 0.61: C7.2 74.3,72.39 73.03,73.66 61.59,73.66 60.32,74.93 RASPBERRY_PI.2
+9V  (via drill 0.6)
  Top 0.305: v71.75,66.67 C8.1 | C10.1 92.08,70.48 PONT_H_FILET_2.4
  Top 0.61: v64.77,66.04 64.14,65.41 64.14,59.69 62.86,58.42 62.86,56.52 64.77,54.61 66.04,54.61 66.67,55.24 99.69,55.24 100.97,53.98 DC3.3
  Bottom 0.305: 99.06,78.74 103.5,74.3 C19.+
  Bottom 0.61: v71.75,66.67 65.41,66.67 v64.77,66.04 | v71.75,66.67 83.19,66.67 | 83.19,66.67 90.8,66.67 92.08,65.41 PONT_H_FILET_2.4 | 83.19,66.67 C21.+ 83.31,72.39 95.88,72.39 99.06,75.56 99.06,78.74 101.6,81.28 AX12_FILET.2 | PONT_H_FILET_1.4 v71.75,66.67 | DC3.3 103.5,50.8 C5.+
+9V_AV
  Top 0.61: AX12_DIRECTION.2 84.45,5.08 83.19,6.35 83.19,9.53 85.72,12.06 C20.+ 91.44,18.41 C22.+ 102.23,18.41 DC4.3
+12V
  Top 0.305: DC3.1 104.77,45.72 C6.+ | DC1.1 R12.1 | C25.1 71.75,16.51 | 83.19,27.3 83.19,26.67
  Top 1.27: C2.+ 85.72,44.45 DC1.1 | C2.+ 99.69,44.45 DC3.1 | C2.+ 89.53,39.37 91.44,37.47 139.06,37.47 140.34,38.73 C12.1 PONT_H_M_D.4 | 83.19,27.3 C23.+ 102.23,27.3 DC4.1 | 83.19,12.75 83.19,12.7 78.11,7.62 77.47,7.62 71.75,13.34 71.75,16.51 71.75,17.14 73.66,19.05 PONT_H_M_G.4
  Top 2.54: BOUTON_AR_URG.2 83.19,12.75 83.19,23.5 | 91.44,37.47 91.44,34.92 83.19,26.67 83.19,23.5 | C13.+ 83.19,23.5
CLIGNOTANT_D_CTRL
  Top 0.305: R16.2 U$2.35/A16
CLIGNOTANT_G_CTRL
  Top 0.305: U$2.37/A18 R14.2
COD_AR_D_A  (via drill 0.6)
  Top 0.305: U$2.13 34.92,53.34 33.02,55.24 33.02,67.94 43.81,78.74 53.34,78.74 57.15,74.93 v62.23,74.93 | COD_AR_D.3 139.06,86.36 138.43,87 100.33,87 99.69,86.36 99.69,80.64 96.84,77.79 v96.84,77.47
  Bottom 0.305: v62.23,74.93 78.74,74.93 80.01,76.2 80.01,78.74 80.64,79.38 90.8,79.38 92.71,77.47 93.82,77.47 94.77,76.52 95.88,76.52 v96.84,77.47
COD_AR_D_B  (via drill 0.6)
  Top 0.305: U$2.14/A0 32.38,68.58 43.18,79.38 53.97,79.38 57.15,76.2 v61.59,76.2 | COD_AR_D.4 141.6,87 140.97,87.63 99.69,87.63 99.06,87 99.06,81.28 v95.41,77.63
  Bottom 0.305: v61.59,76.2 78.74,76.2 79.38,76.83 79.38,79.38 80.01,80.01 91.44,80.01 93.34,78.11 95.25,78.11 95.41,77.95 v95.41,77.63
COD_AR_G_A
  Top 0.305: U$2.16/A2 31.12,55.88 31.12,69.85 37.46,76.2 COD_AR_G.3
COD_AR_G_B
  Top 0.305: U$2.15/A1 29.84,53.34 31.75,55.24 31.75,69.22 40.01,77.47 COD_AR_G.4
DEL_CLIGNOTANT_D  (via drill 0.6)
  Top 0.305: v93.34,76.2 93.66,76.52 96.36,76.52 96.68,76.2 118.11,76.2 v118.75,76.83 118.75,84.45 119.38,85.09 124.46,85.09 125.09,84.45 PHARES_AR_D.6
  Bottom 0.305: R17.2 62.86,72.39 65.41,69.85 74.93,69.85 80.64,75.56 80.64,78.11 81.28,78.74 90.17,78.74 92.71,76.2 v93.34,76.2 | v118.75,76.83 118.75,69.22 119.38,68.58 147.32,68.58 148.59,67.31 148.59,60.33 149.22,59.69 153.67,59.69 155.57,57.78 155.57,45.72 154.31,44.45 151.13,44.45 150.5,43.81 150.5,36.2 139.06,24.77 121.28,24.77 120.02,23.5 PHARES_AV_D.6
DEL_CLIGNOTANT_G  (via drill 0.6)
  Top 0.305: PHARES_AV_G.6 56.52,24.13 50.16,30.48 50.16,31.75 47.62,34.29 46.99,34.29 45.72,35.56 44.45,35.56 43.81,36.2 v43.81,38.1 | v43.81,50.8 v43.81,59.05 | v48.89,60.96 48.89,62.87 48.26,63.5 47.62,63.5 46.99,64.14 46.99,74.3 47.62,74.93 R15.2
  Bottom 0.305: R15.2 PHARES_AR_G.6 | v43.81,38.1 v43.81,50.8 | v43.81,59.05 45.09,60.33 48.26,60.33 v48.89,60.96
DEL_ECLAIRAGE  (via drill 0.6)
  Top 0.305: v63.5,22.86 66.67,26.04 R25.2 66.67,31.75 71.75,36.83 80.01,36.83 v84.45,32.38 | v95.88,29.21 116.84,29.21 117.47,28.57 PHARES_AV_D.4
  Bottom 0.305: PHARES_AV_G.4 53.97,22.86 54.61,23.5 62.86,23.5 v63.5,22.86 | v95.88,29.21 87.63,29.21 v84.45,32.38
DEL_FEUX_NUIT  (via drill 0.6)
  Top 0.305: v46.35,77.47 43.81,77.47 33.66,67.31 33.66,55.88 36.2,53.34 v36.2,50.8 | v64.14,42.55 v36.2,42.55 | v105.41,56.52 106.68,56.52 109.22,59.05 119.38,59.05 121.28,57.15 127.63,57.15 128.91,58.42 128.91,82.55 PHARES_AR_D.8
  Bottom 0.305: PHARES_AR_G.8 v46.35,77.47 | R26.2 v64.14,42.55 71.75,42.55 73.03,43.81 73.03,53.98 74.3,55.24 104.14,55.24 v105.41,56.52 | v36.2,50.8 v36.2,42.55
DEL_FREIN  (via drill 0.6)
  Top 0.305: R19.2 v56.52,72.39 | v95.25,75.41 95.41,75.56 120.65,75.56 121.28,76.2 121.28,82.55 PHARES_AR_D.4
  Bottom 0.305: R19.2 52.07,74.93 51.43,75.56 PHARES_AR_G.4 | v56.52,72.39 56.52,71.75 57.15,71.12 62.86,71.12 64.77,69.22 75.56,69.22 81.28,74.93 81.28,77.47 81.91,78.11 88.9,78.11 92.08,74.93 94.77,74.93 v95.25,75.41
DEL_RECUL  (via drill 0.6)
  Top 0.305: R23.2 46.35,74.93 48.89,77.47 v52.7,77.47 | v57.78,85.09 58.42,85.72 67.47,85.72 v67.95,85.25
  Bottom 0.305: PHARES_AR_G.10 R23.2 | v52.7,77.47 53.34,77.47 57.15,81.28 57.15,84.45 v57.78,85.09 | v67.95,85.25 68.1,85.25 70.48,87.63 95.25,87.63 95.88,88.27 129.54,88.27 130.18,87.63 PHARES_AR_D.10
DEL_STATUS_1  (via drill 0.6)
  Top 0.305: TABLEAU_DE_BORD.4 93.34,7.62 90.17,7.62 v89.53,6.99
  Bottom 0.305: v89.53,6.99 88.9,6.35 83.82,6.35 80.64,3.17 68.58,3.17 64.14,7.62 34.92,7.62 26.04,16.51 18.41,16.51 13.33,21.59 13.33,23.5 12.06,24.77 10.16,24.77 9.52,25.4 R20.1
DEL_STATUS_2  (via drill 0.6)
  Top 0.305: TABLEAU_DE_BORD.6 95.25,8.26 v88.27,8.26 | v67.95,5.71 66.04,7.62 66.04,17.14 52.7,30.48 R21.1
  Bottom 0.305: v88.27,8.26 87.63,8.89 84.45,8.89 83.19,7.62 83.19,6.99 80.01,3.81 69.22,3.81 67.95,5.08 v67.95,5.71
FEUX_FREIN_CTRL
  Top 0.305: R18.2 U$2.36/A17
FEUX_NUIT_CTRL
  Bottom 0.305: U$2.30 R24.2
FEUX_RECUL_CTRL
  Top 0.305: U$2.38/A19 R22.2
FILET_BUTEE_D  (via drill 0.6)
  Top 0.305: U$2.A21 R8.2 42.55,59.69 43.18,60.33 46.35,60.33 47.62,59.05 50.8,59.05 52.07,60.33 62.23,60.33 62.86,60.96 v62.86,66.67
  Bottom 0.305: FILET_MOTEURS+BUTEES.9 92.08,80.64 93.98,78.74 97.79,78.74 98.11,78.42 98.11,75.88 96.52,74.3 82.55,74.3 81.28,73.03 81.28,68.58 80.64,67.94 64.14,67.94 v62.86,66.67
FILET_BUTEE_G
  Top 0.305: FILET_MOTEURS+BUTEES.1 67.31,81.28 66.67,80.64 66.67,74.3 61.59,69.22 61.59,61.59 60.96,60.96 51.43,60.96 50.16,59.69 48.26,59.69 46.99,60.96 42.55,60.96 40.01,58.42 R6.1 U$2.A22
FILET_MD_+
  Top 0.406: 91.44,79.76 91.44,80.01 90.8,80.64 90.8,82.55 FILET_MOTEURS+BUTEES.8
  Top 0.61: PONT_H_FILET_2.13 103.5,60.33 106.68,63.5 106.68,66.04 104.77,67.94 97.79,67.94 97.16,68.58 97.16,72.39 95.88,73.66 93.98,73.66 91.44,76.2 91.44,79.76
FILET_MD_-
  Top 0.61: PONT_H_FILET_2.14 104.77,65.41 103.5,66.67 96.52,66.67 95.88,67.31 95.88,71.75 95.25,72.39 93.34,72.39 90.17,75.56 90.17,80.01 89.53,80.64 FILET_MOTEURS+BUTEES.7
FILET_MD_IN_A
  Bottom 0.305: PONT_H_FILET_2.10 99.69,63.5 98.74,62.55 66.99,62.55 60.96,56.52 58.42,56.52 57.78,57.15 25.4,57.15 24.77,56.52 12.7,56.52 12.06,55.88 R11.2 U$2.22/A8
FILET_MF_+
  Top 0.406: 88.9,79.63 88.9,80.01 88.27,80.64 88.27,82.55 FILET_MOTEURS+BUTEES.6
  Top 0.61: PONT_H_FILET_2.2 89.53,67.94 90.8,69.22 90.8,73.03 88.9,74.93 88.9,79.63
FILET_MF_-
  Top 0.61: PONT_H_FILET_2.3 87.95,62.55 87.95,68.9 88.9,69.85 88.9,72.39 87.63,73.66 87.63,80.01 87,80.64 FILET_MOTEURS+BUTEES.5
FILET_MF_IN_A
  Bottom 0.305: PONT_H_FILET_2.5 93.34,58.42 92.71,57.78 67.31,57.78 66.67,58.42 65.41,58.42 62.23,55.24 57.15,55.24 56.52,55.88 26.67,55.88 26.04,55.24 17.78,55.24 R10.2 U$2.20/A6
FILET_MG_+
  Top 0.406: 85.72,80.01 85.72,82.55 FILET_MOTEURS+BUTEES.4
  Top 0.61: PONT_H_FILET_1.13 86.04,62.55 86.04,79.69 85.72,80.01
FILET_MG_-
  Top 0.61: FILET_MOTEURS+BUTEES.3 84.45,77.47 85.09,76.83 85.09,71.75 84.45,71.12 PONT_H_FILET_1.14
FILET_MG_IN_A
  Bottom 0.305: PONT_H_FILET_1.10 79.38,64.14 78.42,63.18 66.36,63.18 60.32,57.15 59.05,57.15 58.42,57.78 24.77,57.78 24.13,57.15 10.16,57.15 9.52,56.52 R5.2 U$2.23/A9
FILET_MOTEURS_COM  (via drill 0.6)
  Top 0.305: PONT_H_FILET_1.12 v81.91,61.28 | PONT_H_FILET_2.12 v102.23,61.28
  Bottom 0.305: 95.88,61.28 v81.91,61.28 66.99,61.28 61.59,55.88 57.78,55.88 57.15,56.52 26.04,56.52 25.4,55.88 15.24,55.88 14.61,55.24 R9.2 U$2.21/A7 | 95.88,61.28 PONT_H_FILET_2.7 | v102.23,61.28 95.88,61.28
GET_COLOR  (via drill 0.6)
  Top 0.305: TABLEAU_DE_BORD.8 99.69,6.99 97.16,9.53 92.08,9.53 v90.8,10.79
  Bottom 0.305: v90.8,10.79 83.82,10.79 81.91,8.89 81.91,8.26 78.74,5.08 71.12,5.08 70.48,5.71 70.48,8.89 69.85,9.53 34.29,9.53 26.67,17.14 19.05,17.14 13.97,22.23 13.97,24.13 12.7,25.4 11.43,25.4 10.79,26.04 10.79,38.1 11.43,38.73 12.06,38.73 U$2.A25
GND  (via drill 0.6)
  Bottom 1.27: C4.- 117.47,40.64 | 117.47,40.64 C3.- | 117.47,40.64 DC2.2 117.47,46.99 118.75,48.26 119.38,48.9 | C5.- 106.05,48.26 | 106.05,48.26 C6.- | DC3.2 106.05,48.26 | 89.53,48.26 DC1.2 83.19,48.26 81.91,46.99 81.91,33.02 | 89.53,48.26 C1.- | C2.- 89.53,48.26 | 81.91,33.02 81.91,17.14 80.01,15.24 PONT_H_M_G.1 | PONT_H_M_D.1 144.15,54.61 142.88,55.88 126.36,55.88 | 126.36,55.88 118.75,55.88 | PONT_H_M_D.15 126.36,55.88 | PONT_H_M_G.15 81.91,33.02
  Bottom 2.54: POWER.2 109.91,60.96 | DC1.2 109.86,48.26 109.91,48.31 109.91,60.96 | 109.91,60.96 118.75,60.96 118.75,55.88 118.75,48.26
  other vias: 62.86,68.58
  pour Bottom: -4.45,91.44 165.73,91.44 165.73,-1.91 -4.45,-1.91
  pour Top: -5.08,92.08 166.37,92.08 166.37,-2.54 -5.08,-2.54
JUMPER  (via drill 0.6)
  Top 0.305: v19.68,71.12 13.33,64.77 13.33,50.8 U$2.A10 | v61.59,84.45 62.23,83.82 72.39,83.82 v73.03,84.45
  Bottom 0.305: JUMPER.1 v73.03,84.45 | v61.59,84.45 59.69,84.45 59.05,83.82 59.05,74.3 58.42,73.66 43.18,73.66 41.91,72.39 20.95,72.39 v19.68,71.12
MOTEUR_D_+
  Bottom 1.27: MOTEUR_DROIT.1 141.6,35.56 142.88,36.83 142.88,43.81 | 142.88,43.81 PONT_H_M_D.2 | PONT_H_M_D.14 127.63,45.09 128.91,43.81 142.88,43.81
MOTEUR_D_-
  Top 1.27: MOTEUR_DROIT.2 139.06,33.66 142.88,37.47 142.88,40.01 146.69,43.81 146.69,52.7 146.05,53.34 141.6,53.34 | 141.6,53.34 129.54,53.34 128.91,52.7 PONT_H_M_D.13 | PONT_H_M_D.3 141.6,53.34
MOTEUR_D_A  (via drill 0.6)
  Top 0.305: U$2.4 16.51,38.73 19.05,38.73 21.59,41.27 v83.82,41.27 | v106.68,41.27 111.12,41.27 113.03,43.18 128.27,43.18 130.18,45.09 PONT_H_M_D.12 132.08,48.26 137.16,48.26 139.06,50.16 PONT_H_M_D.5
  Bottom 0.305: v83.82,41.27 v106.68,41.27 | U$2.4 R2.2
MOTEUR_D_B  (via drill 0.6)
  Top 0.305: U$2.6 19.68,37.47 22.86,40.64 82.55,40.64 83.19,40.01 84.45,40.01 v87,42.55 | v107.95,42.55 111.12,42.55 112.39,43.81 122.55,43.81 124.46,45.72 v124.46,48.26
  Bottom 0.305: v87,42.55 v107.95,42.55 | U$2.6 R1.2 | v124.46,48.26 130.81,48.26 | 130.81,48.26 132.08,49.53 134.62,49.53 PONT_H_M_D.7 | PONT_H_M_D.10 130.81,48.26
MOTEUR_D_COD_A  (via drill 0.6)
  Top 0.305: U$2.11 35.56,40.01 81.91,40.01 82.55,39.37 85.09,39.37 v87,37.47 | v100.97,34.29 126.36,34.29 127.63,35.56 130.18,35.56 131.44,34.29 MOTEUR_DROIT.5
  Bottom 0.305: v87,37.47 90.17,34.29 v100.97,34.29
MOTEUR_D_COD_B  (via drill 0.6)
  Top 0.305: U$2.12 37.46,39.37 81.28,39.37 81.91,38.73 83.82,38.73 v84.45,38.1 | v99.69,33.02 MOTEUR_DROIT.6
  Bottom 0.305: v84.45,38.1 89.53,33.02 v99.69,33.02
MOTEUR_G_+  (via drill 1)
  Top 1.27: MOTEUR_GAUCHE.1 48.26,29.84 v48.26,24.77
  Bottom 1.27: v48.26,24.77 66.04,24.77 67.31,23.5 71.75,23.5 | PONT_H_M_G.2 73.03,16.51 71.75,17.78 71.75,23.5 | PONT_H_M_G.14 73.03,31.75 71.75,30.48 71.75,23.5
MOTEUR_G_-
  Bottom 1.27: MOTEUR_GAUCHE.2 42.55,31.75 47.62,26.67 66.67,26.67 69.85,29.84 69.85,31.11 72.39,33.66 75.56,33.66 76.83,32.38 76.83,30.48 | PONT_H_M_G.3 78.11,17.78 76.83,19.05 76.83,30.48 | PONT_H_M_G.13 76.83,30.48
MOTEUR_G_A  (via drill 0.6)
  Top 0.305: v76.2,14.61 76.2,20.32 | 76.2,20.32 76.2,27.3 PONT_H_M_G.12 | PONT_H_M_G.5 76.2,20.32
  Bottom 0.305: U$2.3 R29.2 12.06,31.11 13.33,29.84 13.33,26.04 14.61,24.77 14.61,22.86 19.68,17.78 27.3,17.78 29.21,15.88 66.04,15.88 67.31,14.61 v76.2,14.61
MOTEUR_G_B  (via drill 0.6)
  Top 0.305: 72.39,26.67 72.39,22.23 71.75,21.59 v69.85,21.59 | 72.39,26.67 72.39,32.38 73.66,33.66 76.2,33.66 77.47,32.38 77.47,24.77 PONT_H_M_G.7 | PONT_H_M_G.10 72.39,26.67
  Bottom 0.305: U$2.5 R28.2 17.14,31.11 15.88,29.84 15.88,22.86 20.32,18.41 27.94,18.41 29.84,16.51 66.04,16.51 69.85,20.32 v69.85,21.59
MOTEUR_G_COD_A
  Top 0.305: U$2.8 26.04,35.56 33.66,35.56 34.92,34.29 MOTEUR_GAUCHE.5
MOTEUR_G_COD_B
  Top 0.305: U$2.7 26.04,33.02 MOTEUR_GAUCHE.6
N$2
  Top 0.305: R14.1 50.8,62.87 50.8,66.04 49.53,67.31 T1.B
N$4
  Top 0.305: R12.2 66.04,48.9 15.24,48.9 U$2.A11
  Bottom 0.305: R12.2 R13.1
N$5
  Bottom 0.305: T1.E R15.1
N$8
  Bottom 0.305: U$4.K- 155.57,40.64 R27.1
N$9
  Bottom 3.048: POWER.1 114.94,81.28 U$1.A
N$11
  Top 0.305: T2.B 58.42,67.31 56.52,65.41 56.52,63.5 R16.1
N$12
  Top 0.305: T2.E R17.1
N$15
  Top 0.305: T3.B 53.34,67.31 52.07,66.04 52.07,62.87 R18.1
N$16
  Bottom 0.305: T3.E R19.1
N$19
  Bottom 0.305: U$2.2 R20.2
N$20
  Bottom 0.305: U$2.29 R21.2
N$21
  Top 0.305: R22.1 46.35,63.5 46.35,66.67 45.72,67.31 T4.B
N$22
  Bottom 0.305: T4.E R23.1
N$25
  Bottom 0.305: R24.1 T5.B
N$26
  Bottom 0.305: T5.E R25.1 R26.1
RASPBERRY_RX
  Bottom 0.305: U$2.1 5.71,38.1 5.71,63.5 6.35,64.14 13.33,64.14 13.97,64.77 13.97,86.36 14.61,87 62.23,87 62.86,86.36 RASPBERRY_PI.3
RASPBERRY_TX
  Bottom 0.305: U$2.0 4.44,48.26 3.17,49.53 3.17,64.14 3.81,64.77 12.7,64.77 13.33,65.41 13.33,87 13.97,87.63 64.77,87.63 65.41,87 RASPBERRY_PI.4
SCL
  Top 0.305: TOF_FLAN_AV_G.4 25.4,27.94 31.75,21.59 54.61,21.59 55.24,20.95 55.24,19.05 PHARES_AV_G.5 57.78,16.51 57.78,2.54 58.42,1.91 82.55,1.91 83.19,1.27 92.71,1.27 93.34,1.91 93.34,4.45 93.98,5.08 95.88,5.08 TABLEAU_DE_BORD.5 | PHARES_AV_D.5 121.92,15.88 153.03,15.88 154.31,17.14 154.31,21.59 153.03,22.86 TOF_FLAN_AV_D.4 148.59,26.04 148.59,31.75 149.86,33.02 156.21,33.02 156.84,33.66 156.84,60.33 156.21,60.96 TOF_FLAN_AR_D.4 | PHARES_AR_G.5 48.89,87 49.53,87.63 95.25,87.63 98.42,84.45 98.42,82.55 FILET_MOTEURS+BUTEES.13 | U$2.19/A5 19.68,56.52 19.05,57.15 19.05,64.77 20.32,66.04 TOF_FLAN_AR_G.4
  Bottom 0.305: U$2.19/A5 20.95,50.8 20.95,33.66 19.68,32.38 19.68,29.21 20.95,27.94 TOF_FLAN_AV_G.4 | TABLEAU_DE_BORD.5 98.42,5.08 98.42,6.99 99.06,7.62 118.75,7.62 120.02,8.89 PHARES_AV_D.5 | TOF_FLAN_AR_D.4 154.94,60.96 155.57,61.59 155.57,69.85 154.94,70.48 125.73,70.48 125.09,71.12 PHARES_AR_D.5 126.36,82.55 126.36,87 125.73,87.63 99.06,87.63 98.42,87 98.42,82.55 FILET_MOTEURS+BUTEES.13 | TOF_FLAN_AR_G.4 16.51,66.04 15.88,66.67 15.88,84.45 16.51,85.09 48.26,85.09 48.89,84.45 PHARES_AR_G.5
SDA
  Top 0.305: TOF_FLAN_AV_G.3 26.67,25.4 31.12,20.95 47.62,20.95 49.53,19.05 52.7,19.05 PHARES_AV_G.3 55.24,16.51 55.24,2.54 56.52,1.27 81.91,1.27 82.55,0.64 93.34,0.64 94.61,1.91 TABLEAU_DE_BORD.3 | PHARES_AV_D.3 120.02,15.24 153.67,15.24 154.94,16.51 154.94,24.13 153.67,25.4 TOF_FLAN_AV_D.3 150.5,25.4 149.22,26.67 149.22,31.11 150.5,32.38 156.84,32.38 157.48,33.02 157.48,62.87 156.84,63.5 TOF_FLAN_AR_D.3 | PHARES_AR_G.3 51.43,86.36 52.07,87 93.34,87 95.88,84.45 95.88,82.55 FILET_MOTEURS+BUTEES.11 | U$2.18/A4 22.23,55.24 19.68,57.78 19.68,62.23 20.95,63.5 TOF_FLAN_AR_G.3
  Bottom 0.305: U$2.18/A4 22.23,39.37 23.49,38.1 23.49,33.66 24.77,32.38 24.77,26.67 23.49,25.4 TOF_FLAN_AV_G.3 | TABLEAU_DE_BORD.3 95.88,5.08 95.88,6.99 97.16,8.26 116.2,8.26 117.47,9.53 PHARES_AV_D.3 | TOF_FLAN_AR_D.3 154.31,63.5 154.94,64.14 154.94,69.22 154.31,69.85 123.19,69.85 122.55,70.48 PHARES_AR_D.3 123.83,82.55 123.83,86.36 123.19,87 99.69,87 99.06,86.36 99.06,81.28 97.79,80.01 96.52,80.01 95.25,81.28 FILET_MOTEURS+BUTEES.11 | TOF_FLAN_AR_G.3 19.68,63.5 18.41,64.77 15.88,64.77 15.24,65.41 15.24,85.09 15.88,85.72 50.8,85.72 51.43,85.09 PHARES_AR_G.3
STANDBY_12V
  Bottom 1.27: DC2.1 113.66,46.99 | C4.+ 112.39,41.91
  Bottom 2.54: BOUTON_AR_URG.1 73.05,8.91 75.56,11.43 80.01,11.43 83.82,15.24 103.5,15.24 112.39,24.13 112.39,41.91 113.66,43.18 113.66,46.99 114.94,48.26 U$1.C
TOF_BACK_EN  (via drill 0.6)
  Top 0.305: FILET_MOTEURS+BUTEES.10 90.17,85.72 80.64,85.72 78.11,83.19 64.77,83.19 64.14,82.55 64.14,73.03 60.96,69.85 60.96,64.14 60.32,63.5 58.42,63.5 v57.78,62.87 | U$2.34/A15 v57.78,59.05
  Bottom 0.305: v57.78,59.05 v57.78,62.87
TOF_FLAN_AR_D_EN  (via drill 0.6)
  Top 0.305: v121.92,58.42 120.65,59.69 108.58,59.69 106.68,57.78 104.77,57.78 v103.5,56.52
  Bottom 0.305: TOF_FLAN_AR_D.5 v121.92,58.42 | U$2.31/A12 57.78,50.16 58.42,50.8 66.04,50.8 66.67,51.44 66.67,55.24 67.31,55.88 102.87,55.88 v103.5,56.52
TOF_FLAN_AR_G_EN  (via drill 0.6)
  Top 0.305: TOF_FLAN_AR_G.5 23.49,68.58 24.77,67.31 24.77,56.52 23.49,55.24 v23.49,50.8
  Bottom 0.305: U$2.25 42.55,38.1 41.91,38.73 24.13,38.73 23.49,39.37 v23.49,50.8
TOF_FLAN_AV_D_EN  (via drill 0.6)
  Top 0.305: U$2.32/A13 60.32,37.47 60.96,38.1 82.55,38.1 v84.45,36.2 | v98.42,31.75 126.36,31.75 137.8,20.32 TOF_FLAN_AV_D.5
  Bottom 0.305: v84.45,36.2 88.9,31.75 v98.42,31.75
TOF_FLAN_AV_G_EN
  Top 0.305: TOF_FLAN_AV_G.5 25.4,30.48 26.67,29.21 38.1,29.21 38.73,29.84 38.73,35.56 U$2.24
TOF_FRONT_EN  (via drill 0.6)
  Top 0.305: TABLEAU_DE_BORD.7 98.42,5.08 98.42,6.99 96.52,8.89 90.17,8.89 v89.53,9.53 | v69.22,6.99 66.67,9.53 66.67,17.78 53.97,30.48 53.97,32.38 53.34,33.02 51.43,33.02 U$2.27
  Bottom 0.305: v89.53,9.53 83.82,9.53 82.55,8.26 82.55,7.62 79.38,4.45 69.85,4.45 69.22,5.08 v69.22,6.99
TOF_PHARE_AR_D_EN  (via drill 0.6)
  Top 0.305: PHARES_AR_D.7 127.63,76.2 126.36,74.93 109.22,74.93 107.95,73.66 107.95,61.91 v107.31,61.28
  Bottom 0.305: v107.31,61.28 107.95,60.64 107.95,59.05 107,58.1 94.93,58.1 93.34,56.52 66.67,56.52 66.04,55.88 66.04,52.07 65.41,51.44 60.96,51.44 U$2.33/A14
TOF_PHARE_AR_G_EN  (via drill 0.6)
  Top 0.305: v41.91,73.98 41.91,66.04 38.73,62.87 38.73,50.16 39.37,49.53 44.45,49.53 45.09,50.16 U$2.39/A20
  Bottom 0.305: PHARES_AR_G.7 45.09,82.55 43.18,82.55 41.91,81.28 v41.91,73.98
TOF_PHARE_AV_D_EN  (via drill 0.6)
  Top 0.305: U$2.28 51.43,35.56 61.59,35.56 63.5,37.47 81.28,37.47 v84.45,34.29 | v97.16,30.48 123.19,30.48 124.46,29.21 124.46,19.68 PHARES_AV_D.7
  Bottom 0.305: v84.45,34.29 88.27,30.48 v97.16,30.48
TOF_PHARE_AV_G_EN
  Top 0.305: PHARES_AV_G.7 60.32,19.05 60.32,21.59 51.43,30.48 51.43,31.75 47.62,35.56 46.99,35.56 45.72,36.83 U$2.26
UART_AX12  (via drill 0.6)
  Top 0.305: v29.21,19.05 v37.46,10.79
  Bottom 0.305: U$2.10 U$2.9 25.4,34.92 25.4,22.86 v29.21,19.05 | U$3.TXI-1 64.14,12.7 62.23,10.79 38.1,10.79 v37.46,10.79
UART_AX12_5V  (via drill 0.6)
  Top 0.305: U$3.TXO-1 64.14,3.17 64.77,2.54 AX12_DIRECTION.3 | AX12_FILET.3 102.23,85.72 102.87,86.36 128.27,86.36 v128.91,85.72
  Bottom 0.305: AX12_DIRECTION.3 154.31,2.54 157.48,5.71 157.48,70.48 156.21,71.75 129.54,71.75 128.91,72.39 v128.91,85.72
VENTILATEUR_+
  Top 0.61: PONT_H_FILET_1.3 67.31,62.87 67.31,67.31 67.95,67.94 VENTILATEUR.1
VENTILATEUR_-
  Top 0.61: PONT_H_FILET_1.2 70.48,66.04 VENTILATEUR.2
VENTILATEUR_EN  (via drill 0.6)
  Top 0.305: U$2.17/A3 R7.2 | PONT_H_FILET_1.5 73.03,57.78 72.39,57.15 v65.72,57.15
  Bottom 0.305: v65.72,57.15 61.91,53.34 28.58,53.34 R7.2

### Text on the board
Reference: AVANT | GAUCHE | DROITE | ARRIERE